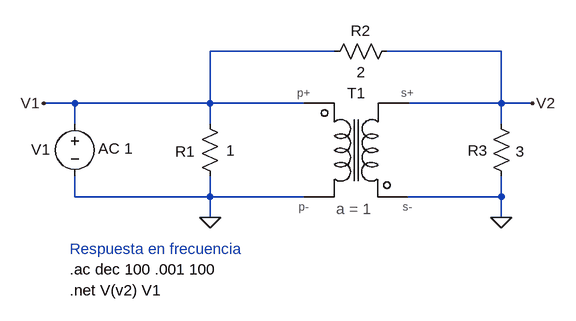
[diagram p0: schematic EJ1.asc]
EJ1.asc, the LTspice schematic file:
Version 4
SHEET 1 880 680
WIRE -448 96 -640 96
WIRE -192 96 -368 96
WIRE -848 176 -896 176
WIRE -640 176 -640 96
WIRE -640 176 -848 176
WIRE -496 176 -640 176
WIRE -192 176 -192 96
WIRE -192 176 -336 176
WIRE -144 176 -192 176
WIRE -848 208 -848 176
WIRE -640 208 -640 176
WIRE -192 208 -192 176
WIRE -848 320 -848 288
WIRE -640 320 -640 288
WIRE -640 320 -848 320
WIRE -496 320 -640 320
WIRE -192 320 -192 288
WIRE -192 320 -336 320
WIRE -640 352 -640 320
WIRE -192 352 -192 320
FLAG -640 352 0
FLAG -192 352 0
FLAG -896 176 V1
FLAG -144 176 V2
SYMBOL voltage -848 192 R0
WINDOW 123 36 54 Left 2
WINDOW 0 -67 55 Left 2
SYMATTR Value2 AC 1
SYMATTR InstName V1
SYMATTR SpiceLine Rser=0.1
SYMATTR Value ""
SYMBOL res -208 192 R0
WINDOW 0 -36 57 Left 2
WINDOW 3 38 58 Left 2
SYMATTR InstName R3
SYMATTR Value 3
SYMBOL res -656 192 R0
WINDOW 0 -38 58 Left 2
WINDOW 3 41 57 Left 2
SYMATTR InstName R1
SYMATTR Value 1
SYMBOL res -352 80 R90
WINDOW 0 0 56 VBottom 2
WINDOW 3 32 56 VTop 2
SYMATTR InstName R2
SYMATTR Value 2
SYMBOL Trafo_Ideal_Componente -288 288 R0
SYMATTR InstName T1
SYMATTR Prefix ""
TEXT -856 432 Left 2 !.ac dec 100 .001 100
TEXT -856 400 Left 2 ;Respuesta en frecuencia
TEXT -856 464 Left 2 !.net V(v2) V1

The netlist it stands for:
* EJ1.asc
V1 V1 0 AC 1 Rser=0.1
R3 V2 0 3
R1 V1 0 1
R2 V2 V1 2
XT1 V1 V2 0 0 Trafo_Ideal_Componente  ; pins p+ s+ p- s-
.ac dec 100 .001 100
* Respuesta en frecuencia
.net V(v2) V1
.backanno
.end